# EAGLE design DualMotorCape-v1 (EAGLE 6.3)
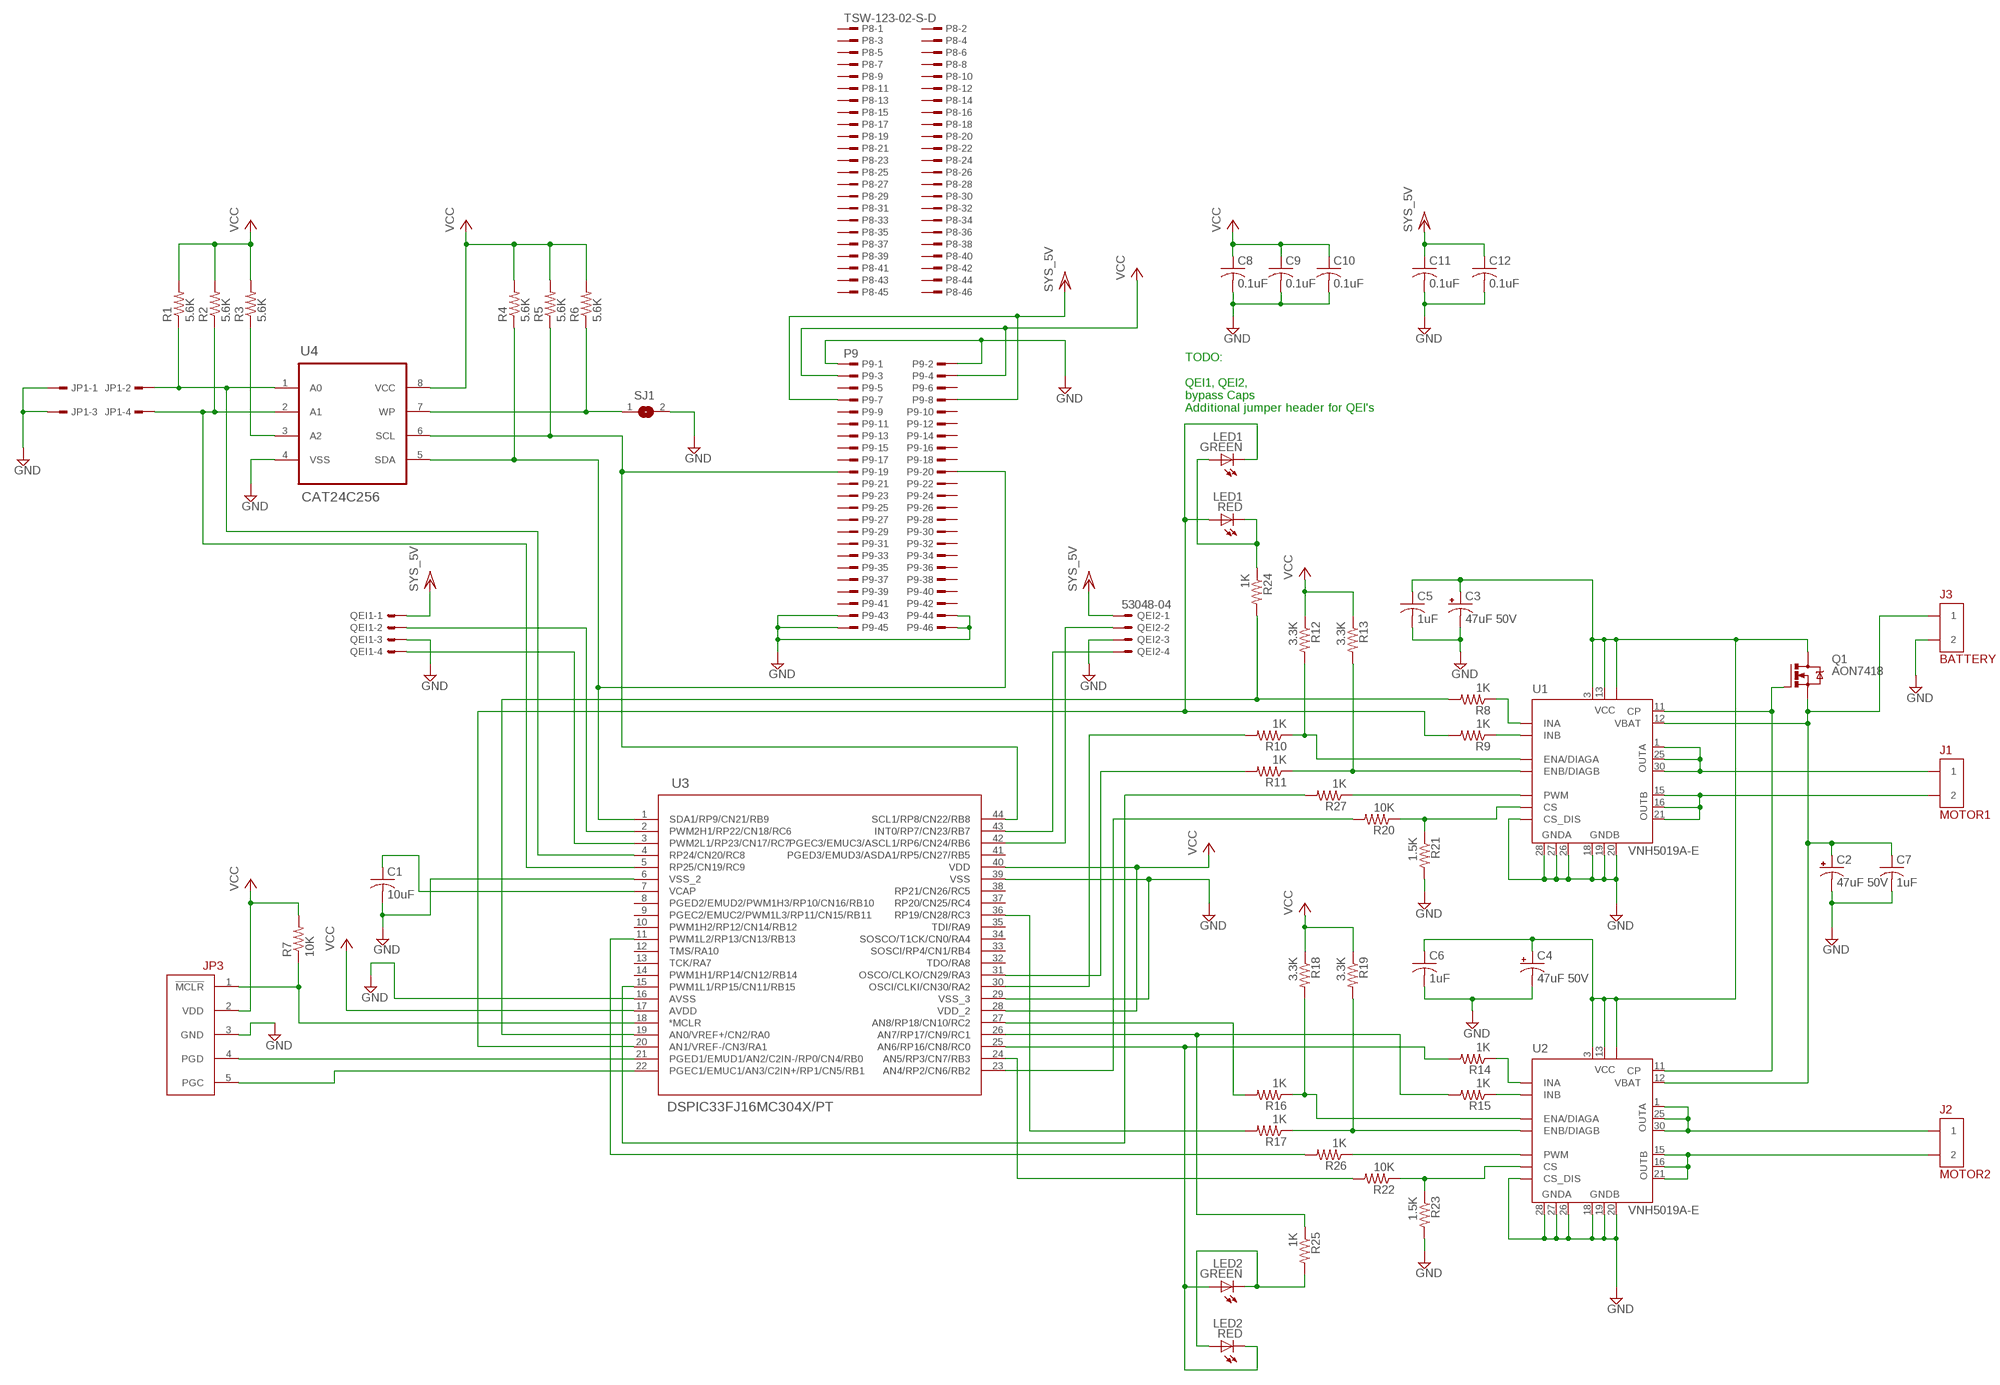
[diagram p0: schematic, sheet 1]

## Parts
C1  10uF  C-USC0805  [C0805]
C2  47uF 50V  CPOL-USUD-6,3X7,7  [UD-6,3X7,7_NICHICON]
C3  47uF 50V  CPOL-USUD-6,3X7,7  [UD-6,3X7,7_NICHICON]
C4  47uF 50V  CPOL-USUD-6,3X7,7  [UD-6,3X7,7_NICHICON]
C5  1uF  C-USC0603  [C0603]
C6  1uF  C-USC0603  [C0603]
C7  1uF  C-USC0603  [C0603]
C8  0.1uF  C-USC0603  [C0603]
C9  0.1uF  C-USC0603  [C0603]
C10  0.1uF  C-USC0603  [C0603]
C11  0.1uF  C-USC0603  [C0603]
C12  0.1uF  C-USC0603  [C0603]
J1  MOTOR1  TERMINAL-BLOCK-2  [TERMINAL-BLOCK-2.54MM-2]
J2  MOTOR2  TERMINAL-BLOCK-2  [TERMINAL-BLOCK-2.54MM-2]
J3  BATTERY  TERMINAL-BLOCK-2  [TERMINAL-BLOCK-2.54MM-2]
JP1  TSW-102-02-S-D  [TSW-102-02-S-D]
JP3  ICD2/3-HEADER  [ICD2/3-HEADER]
LED1  KINGBRIGHT-BI-COLOR-LED  [LED-1.6X1.5MM-BI-COLOR]
LED2  KINGBRIGHT-BI-COLOR-LED  [LED-1.6X1.5MM-BI-COLOR]
P8  TSW-123-02-S-D  [TSW-123-02-S-D]
P9  P9  TSW-123-02-S-D  [TSW-123-02-S-D]
Q1  AON7418  MOSFET-N  [DFN3.3X3.3]
QEI1  53048-04  [53048-04]
QEI2  53048-04  [53048-04]
R1  5.6K  R-US_R0603  [R0603]
R2  5.6K  R-US_R0603  [R0603]
R3  5.6K  R-US_R0603  [R0603]
R4  5.6K  R-US_R0603  [R0603]
R5  5.6K  R-US_R0603  [R0603]
R6  5.6K  R-US_R0603  [R0603]
R7  10K  R-US_R0603  [R0603]
R8  1K  R-US_R0603  [R0603]
R9  1K  R-US_R0603  [R0603]
R10  1K  R-US_R0603  [R0603]
R11  1K  R-US_R0603  [R0603]
R12  3.3K  R-US_R0603  [R0603]
R13  3.3K  R-US_R0603  [R0603]
R14  1K  R-US_R0603  [R0603]
R15  1K  R-US_R0603  [R0603]
R16  1K  R-US_R0603  [R0603]
R17  1K  R-US_R0603  [R0603]
R18  3.3K  R-US_R0603  [R0603]
R19  3.3K  R-US_R0603  [R0603]
R20  10K  R-US_R0603  [R0603]
R21  1.5K  R-US_R0603  [R0603]
R22  10K  R-US_R0603  [R0603]
R23  1.5K  R-US_R0603  [R0603]
R24  1K  R-US_R0603  [R0603]
R25  1K  R-US_R0603  [R0603]
R26  1K  R-US_R0603  [R0603]
R27  1K  R-US_R0603  [R0603]
SJ1  SJ  [SJ]
U1  VNH5019A-E  [VNH5019A-E]
U2  VNH5019A-E  [VNH5019A-E]
U3  DSPIC33FJ16MC304X/PT  [TQFP44_MC]
U4  CAT24C256  [SOIC-8]

## Nets
GND: C1.2 C2.- C3.- C4.- C5.2 C6.2 C7.2 C8.2 C9.2 C10.2 C11.2 C12.2 J3.2 JP1.1 JP1.3 JP3.3(GND) P9.1 P9.2 P9.43 P9.44 P9.45 P9.46 QEI1.3 QEI2.3 R21.2 R23.2 SJ1.2 U1.6(CS_DIS) U1.18(GNDB) U1.19(GNDB) U1.20(GNDB) U1.26(GNDA) U1.27(GNDA) U1.28(GNDA) U2.6(CS_DIS) U2.18(GNDB) U2.19(GNDB) U2.20(GNDB) U2.26(GNDA) U2.27(GNDA) U2.28(GNDA) U3.6(VSS_2) U3.16(AVSS) U3.29(VSS_3) U3.39(VSS) U4.4(VSS)
N$1: C2.+ C7.1 J3.1 Q1.1(S) Q1.2(S) Q1.3(S) U1.12(VBAT) U2.12(VBAT)
N$2: J1.1 U1.1(OUTA) U1.25(OUTA) U1.30(OUTA)
N$3: C3.+ C4.+ C5.1 C6.1 Q1.5(D) Q1.6(D) Q1.7(D) Q1.8(D) U1.3(VCC) U1.13(VCC) U1.23(VCC) U2.3(VCC) U2.13(VCC) U2.23(VCC)
N$4: Q1.4(G) U1.11(CP) U2.11(CP)
N$5: J1.2 U1.15(OUTB) U1.16(OUTB) U1.21(OUTB)
N$6: JP1.2 R1.1 U3.4(RP24/CN20/RC8) U4.1(A0)
N$7: JP1.4 R2.1 U3.5(RP25/CN19/RC9) U4.2(A1)
N$8: J2.1 U2.1(OUTA) U2.25(OUTA) U2.30(OUTA)
N$9: J2.2 U2.15(OUTB) U2.16(OUTB) U2.21(OUTB)
N$10: R3.1 U4.3(A2)
N$11: R6.1 SJ1.1 U4.7(WP)
N$12: P9.19 R5.1 U3.44(SCL1/RP8/CN22/RB8) U4.6(SCL)
N$13: P9.20 R4.1 U3.1(SDA1/RP9/CN21/RB9) U4.5(SDA)
N$14: JP3.5(PGC) U3.22(PGEC1/EMUC1/AN3/C2IN+/RP1/CN5/RB1)
N$15: JP3.1(!MCLR) R7.1 U3.18(*MCLR)
N$16: JP3.4(PGD) U3.21(PGED1/EMUD1/AN2/C2IN-/RP0/CN4/RB0)
N$17: R26.2 U3.11(PWM1L2/RP13/CN13/RB13)
N$18: R11.1 R13.2 U1.9(ENB/DIAGB)
N$19: R10.1 R12.2 U1.5(ENA/DIAGA)
N$20: R27.2 U3.15(PWM1L1/RP15/CN11/RB15)
N$21: R8.1 U1.4(INA)
N$22: R9.1 U1.10(INB)
N$23: R15.1 U2.10(INB)
N$24: R14.1 U2.4(INA)
N$25: R17.1 R19.2 U2.9(ENB/DIAGB)
N$26: R16.1 R18.2 U2.5(ENA/DIAGA)
N$27: R17.2 U3.36(RP19/CN28/RC3)
N$28: R22.1 R23.1 U2.8(CS)
N$29: R20.1 R21.1 U1.8(CS)
N$30: R8.2 R24.2 U3.19(AN0/VREF+/CN2/RA0)
N$31: LED1.1 LED1.4 R9.2 U3.20(AN1/VREF-/CN3/RA1)
N$32: R10.2 U3.30(OSCI/CLKI/CN30/RA2)
N$33: R11.2 U3.31(OSCO/CLKO/CN29/RA3)
N$34: R20.2 U3.23(AN4/RP2/CN6/RB2)
N$35: LED2.2 LED2.3 R14.2 U3.25(AN6/RP16/CN8/RC0)
N$36: R15.2 R25.1 U3.26(AN7/RP17/CN9/RC1)
N$37: R16.2 U3.27(AN8/RP18/CN10/RC2)
N$38: R22.2 U3.24(AN5/RP3/CN7/RB3)
N$39: QEI1.2 U3.2(PWM2H1/RP22/CN18/RC6)
N$40: QEI1.4 U3.3(PWM2L1/RP23/CN17/RC7)
N$41: QEI2.2 U3.42(PGEC3/EMUC3/ASCL1/RP6/CN24/RB6)
N$42: QEI2.4 U3.43(INT0/RP7/CN23/RB7)
N$43: R26.1 U2.7(PWM)
N$44: LED1.2 LED1.3 R24.1
N$45: LED2.1 LED2.4 R25.2
N$46: R27.1 U1.7(PWM)
N$47: C1.1 U3.7(VCAP)
VCC: C8.1 C9.1 C10.1 JP3.2(VDD) P9.3 P9.4 R1.2 R2.2 R3.2 R4.2 R5.2 R6.2 R7.2 R12.1 R13.1 R18.1 R19.1 U3.17(AVDD) U3.28(VDD_2) U3.40(VDD) U4.8(VCC)
VCC/2: C11.1 C12.1 P9.7 P9.8 QEI1.1 QEI2.1 ; supply symbol labelled SYS_5V
Unconnected: P8.1 P8.2 P8.3 P8.4 P8.5 P8.6 P8.7 P8.8 P8.9 P8.10 P8.11 P8.12 P8.13 P8.14 P8.15 P8.16 P8.17 P8.18 P8.19 P8.20 P8.21 P8.22 P8.23 P8.24 P8.25 P8.26 P8.27 P8.28 P8.29 P8.30 P8.31 P8.32 P8.33 P8.34 P8.35 P8.36 P8.37 P8.38 P8.39 P8.40 P8.41 P8.42 P8.43 P8.44 P8.45 P8.46 P9.5 P9.6 P9.9 P9.10 P9.11 P9.12 P9.13 P9.14 P9.15 P9.16 P9.17 P9.18 P9.21 P9.22 P9.23 P9.24 P9.25 P9.26 P9.27 P9.28 P9.29 P9.30 P9.31 P9.32 P9.33 P9.34 P9.35 P9.36 P9.37 P9.38 P9.39 P9.40 P9.41 P9.42 U3.8(PGED2/EMUD2/PWM1H3/RP10/CN16/RB10) U3.9(PGEC2/EMUC2/PWM1L3/RP11/CN15/RB11) U3.10(PWM1H2/RP12/CN14/RB12) U3.12(TMS/RA10) U3.13(TCK/RA7) U3.14(PWM1H1/RP14/CN12/RB14) U3.32(TDO/RA8) U3.33(SOSCI/RP4/CN1/RB4) U3.34(SOSCO/T1CK/CN0/RA4) U3.35(TDI/RA9) U3.37(RP20/CN25/RC4) U3.38(RP21/CN26/RC5) U3.41(PGED3/EMUD3/ASDA1/RP5/CN27/RB5)

## Notes on the sheet
- TODO: 
  
  QEI1, QEI2, 
  bypass Caps
  Additional jumper header for QEI's

## Library data of the parts
C1 C5-C12 = rcl:C-US: CAPACITOR, American symbol
C2-C4 = rcl:CPOL-US: POLARIZED CAPACITOR, American symbol; DIGIKEY: 493-2303-1-ND
J1-J3 = MyCustom:TERMINAL-BLOCK-2
JP1 = con-samtec:TSW-102-02-S-D: THROUGH-HOLE .025" SQ POST HEADER Source: Samtec TSW.pdf; OC_FARNELL: unknown; OC_NEWARK: unknown
JP3 = MyCustom:ICD2/3-HEADER
LED1 LED2 = MyCustom:KINGBRIGHT-BI-COLOR-LED: BI-COLOR SMD CHIP LED 1.6x1.5mm http://www.us.kingbright.com/images/catalog/SPEC/APTB1615ESGC-F01.pdf
P8 P9 = con-samtec:TSW-123-02-S-D: THROUGH-HOLE .025" SQ POST HEADER Source: Samtec TSW.pdf; OC_FARNELL: unknown; OC_NEWARK: unknown
Q1 = MyCustom:MOSFET-N: MOSFET N-Channel http://www.aosmd.com/res/data_sheets/AON7418.pdf http://www.aosmd.com/res/packaging_information/DFN3.3x3.3.pdf
QEI1 QEI2 = con-molex:53?-04: CONNECTOR wire to board 1.25 mm (.049 inch) pitch header; MF: MOLEX; MPN: 53048-0410; OC_FARNELL: 1462887; OC_NEWARK: 57H4721
R1-R27 = rcl:R-US_: RESISTOR, American symbol
SJ1 = jumper:SJ: SMD solder JUMPER
U1 U2 = MyCustom:VNH5019A-E
U3 = MyCustom:DSPIC33FJ16MC304X/PT
U4 = MyCustom:CAT24C256: ON Semi CAT24C256 CMOS Serial EEPROM http://www.onsemi.com/pub_link/Collateral/CAT24C256-D.PDF

## Board
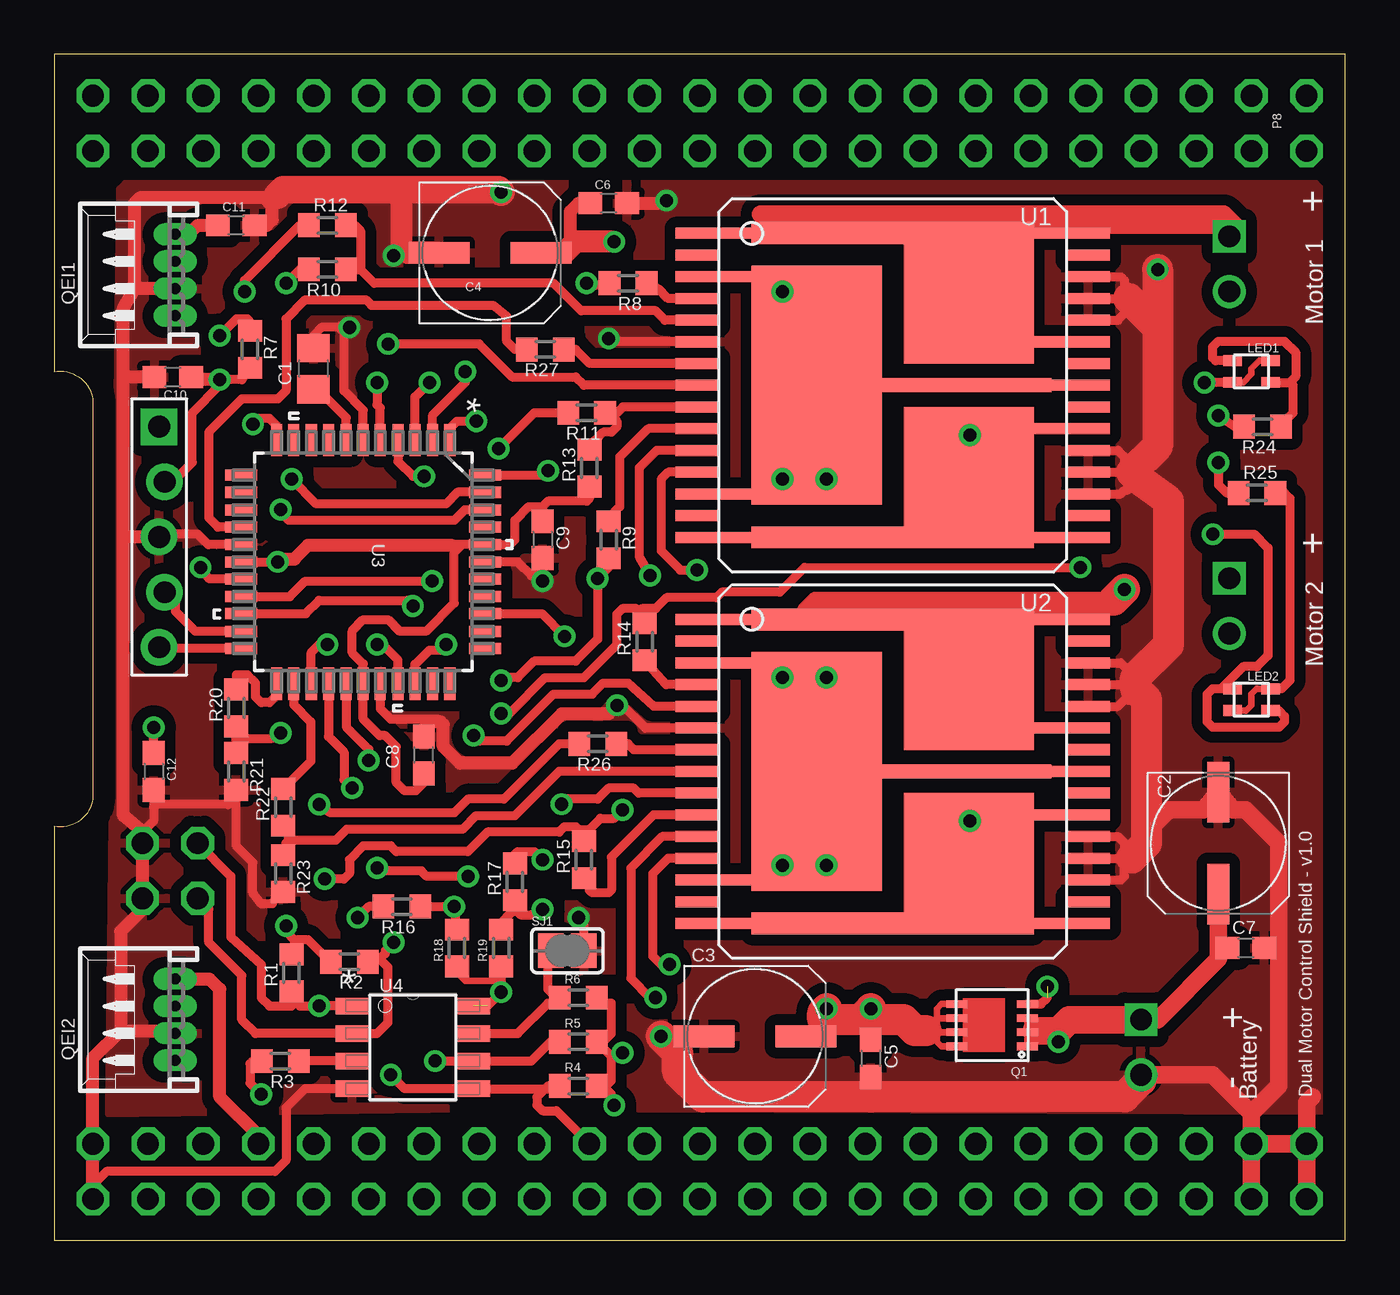
[diagram p1: board, top side]
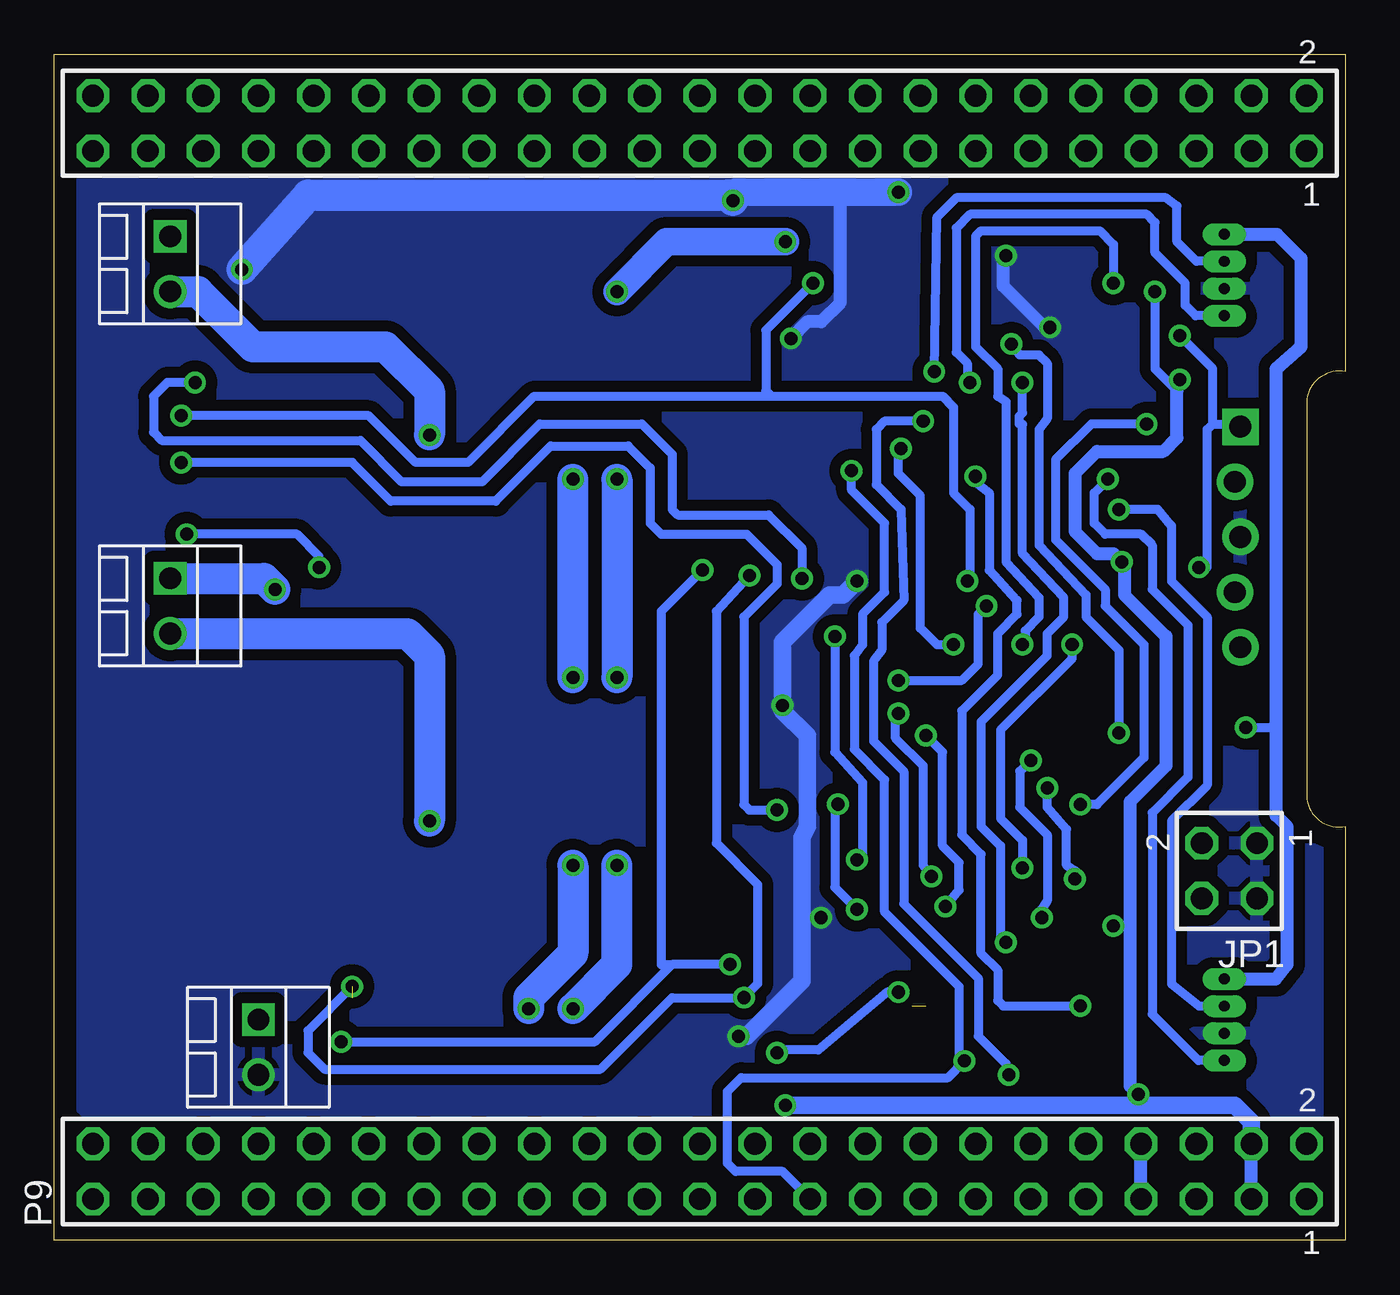
[diagram p2: board, bottom side, seen from below]

Size 59.44 x 54.61 mm. Coordinates in mm from the lower left corner, seen from the top.
Outline: 0,0 59.44,0 59.44,54.61 0,54.61 0,40.01 arc-90 1.78,38.73 1.78,20.32 arc-90 0,19.05 0,0
Copper layers (1*16): Top 0.035mm / dielectric 1.5mm / Bottom 0.035mm
Design rules "default *": minimum track width 10mil, minimum drill 21mil, track to track 8mil, track to pad 8mil, pad to pad 8mil, via to via 8mil, smd to smd 8mil, copper to edge 40mil, drill to drill 8mil, minimum pad ring 10mil, minimum via ring 8mil, stop-mask expansion 4mil, vias tented up to drill 0mil, thermal gap 10mil
bKeepout: area 51.9,10.8 to 58.9,26

### Footprints (pad centres in the part's own frame; a part is rotated, then mirrored left to right if it is on the bottom)
C0805 = smd 1.3 x 1.5: 1 -0.95,0; 2 0.95,0
UD-6,3X7,7_NICHICON = smd 2.8 x 1: + 2.35,0; - -2.35,0
C0603 = smd 1.1 x 1: 1 -0.85,0; 2 0.85,0
TERMINAL-BLOCK-2.54MM-2 = drill 1 square: 1 0,1.27 | drill 1: 2 0,-1.27
TSW-102-02-S-D = drill 1 pad 1.5 octagon: 1 1.27,-1.27; 2 1.27,1.27; 3 -1.27,-1.27; 4 -1.27,1.27
ICD2/3-HEADER = drill 1 pad 1.676 square: 1 0,6.35 | drill 1 pad 1.676: 2 0.254,3.81; 3 0,1.27; 4 0.254,-1.27; 5 0,-3.81
LED-1.6X1.5MM-BI-COLOR = smd 0.85 x 0.5: 1 0.875,0.5; 2 -0.875,0.5; 3 0.875,-0.5; 4 -0.875,-0.5
TSW-123-02-S-D = drill 1 pad 1.5 octagon: 1 27.94,-1.27; 2 27.94,1.27; 3 25.4,-1.27; 4 25.4,1.27; 5 22.86,-1.27; 6 22.86,1.27; 7 20.32,-1.27; 8 20.32,1.27; 9 17.78,-1.27; 10 17.78,1.27; 11 15.24,-1.27; 12 15.24,1.27; 13 12.7,-1.27; 14 12.7,1.27; 15 10.16,-1.27; 16 10.16,1.27; 17 7.62,-1.27; 18 7.62,1.27; 19 5.08,-1.27; 20 5.08,1.27; 21 2.54,-1.27; 22 2.54,1.27; 23 0,-1.27; 24 0,1.27; 25 -2.54,-1.27; 26 -2.54,1.27; 27 -5.08,-1.27; 28 -5.08,1.27; 29 -7.62,-1.27; 30 -7.62,1.27; 31 -10.16,-1.27; 32 -10.16,1.27; 33 -12.7,-1.27; 34 -12.7,1.27; 35 -15.24,-1.27; 36 -15.24,1.27; 37 -17.78,-1.27; 38 -17.78,1.27; 39 -20.32,-1.27; 40 -20.32,1.27; 41 -22.86,-1.27; 42 -22.86,1.27; 43 -25.4,-1.27; 44 -25.4,1.27; 45 -27.94,-1.27; 46 -27.94,1.27
DFN3.3X3.3 = smd 0.95 x 0.35: 1 -1.62,0.975; 2 -1.62,0.325; 3 -1.62,-0.325; 4 -1.62,-0.975; 5 1.62,-0.975; 6 1.62,-0.325; 7 1.62,0.325; 8 1.62,0.975
53048-04 = drill 0.5 pad 0.698 long: 1 1.875,-1.25; 2 0.625,-1.25; 3 -0.625,-1.25; 4 -1.875,-1.25
R0603 = smd 1 x 1.1: 1 -0.85,0; 2 0.85,0
SJ = smd 1.168 x 1.6: 1 -0.762,0; 2 0.762,0
VNH5019A-E = smd 0.508 x 12: 1 -7,-4; 15 7,-4; 16 7,4; 30 -7,4 | smd 0.508 x 2: 2 -6,-9; 4 -4,-9; 5 -3,-9; 6 -2,-9; 7 -1,-9; 8 0,-9; 9 1,-9; 10 2,-9; 11 3,-9; 12 4,-9; 14 6,-9; 17 6,9; 18 5,9; 19 4,9; 20 3,9; 22 1,9; 24 -1,9; 26 -3,9; 27 -4,9; 28 -5,9; 29 -6,9 | smd 0.508 x 4: 3 -5,-8; 13 5,-8; 21 2,8; 23 0,8; 25 -2,8 | smd 6.5 x 6: NC/OUTA -4.25,3.5; NC/OUTB 4.25,3.5 | smd 1 x 7.5: NC/OUTA@1 -7,-2.755; NC/OUTB@1 7,-2.755 | smd 11 x 6: NC/VCC 0,-3.5 | smd 0.65 x 8.3: NC/VCC@1 0,3.145
TQFP44_MC = smd 1.473 x 0.508: 1 -5.613,3.988; 2 -5.613,3.2; 3 -5.613,2.388; 4 -5.613,1.6; 5 -5.613,0.787; 6 -5.613,0; 7 -5.613,-0.787; 8 -5.613,-1.6; 9 -5.613,-2.388; 10 -5.613,-3.2; 11 -5.613,-3.988; 23 5.613,-3.988; 24 5.613,-3.2; 25 5.613,-2.388; 26 5.613,-1.6; 27 5.613,-0.787; 28 5.613,0; 29 5.613,0.787; 30 5.613,1.6; 31 5.613,2.388; 32 5.613,3.2; 33 5.613,3.988 | smd 0.508 x 1.473: 12 -3.988,-5.613; 13 -3.2,-5.613; 14 -2.388,-5.613; 15 -1.6,-5.613; 16 -0.787,-5.613; 17 0,-5.613; 18 0.787,-5.613; 19 1.6,-5.613; 20 2.388,-5.613; 21 3.2,-5.613; 22 3.988,-5.613; 34 3.988,5.613; 35 3.2,5.613; 36 2.388,5.613; 37 1.6,5.613; 38 0.787,5.613; 39 0,5.613; 40 -0.787,5.613; 41 -1.6,5.613; 42 -2.388,5.613; 43 -3.2,5.613; 44 -3.988,5.613
SOIC-8 = smd 1.524 x 0.762: 1 -2.794,1.905; 2 -2.794,0.635; 3 -2.794,-0.635; 4 -2.794,-1.905; 5 2.794,-1.905; 6 2.794,-0.635; 7 2.794,0.635; 8 2.794,1.905

### Placement (x,y rotation side)
C1  11.94,40.13 90 top
C2  53.59,18.29 270 top
C3  32.26,9.4 0 top
C4  20.07,45.47 0 top
C5  37.59,8.38 270 top
C6  25.53,47.75 0 top
C7  54.86,13.46 0 top
C8  17.02,22.35 90 top
C9  22.48,32.26 270 top
C10  5.46,39.75 180 top
C11  8.38,46.74 0 top
C12  4.57,21.59 270 top
J1  54.1,44.96 0 bottom
J2  54.1,29.21 0 bottom
J3  50.04,8.89 0 bottom
JP1  5.33,17.02 90 bottom
JP3  4.83,31.11 0 top
LED1  55.12,40.01 180 top
LED2  55.12,24.89 180 top
P8  29.72,51.44 0 bottom
P9  29.72,3.17 0 bottom
Q1  43.18,9.91 180 top
QEI1  4.32,44.45 90 top
QEI2  4.32,10.16 90 top
R1  10.92,12.32 90 top
R2  13.59,12.83 180 top
R3  10.41,8.26 180 top
R4  24.13,7.11 0 top
R5  24.13,9.14 0 top
R6  24.13,11.18 0 top
R7  9.02,41.02 270 top
R8  26.42,44.07 180 top
R9  25.53,32.26 270 top
R10  12.57,44.7 180 top
R11  24.51,38.1 180 top
R12  12.57,46.74 0 top
R13  24.64,35.56 90 top
R14  27.18,27.56 90 top
R15  24.38,17.53 90 top
R16  16,15.37 180 top
R17  21.21,16.51 90 top
R18  18.54,13.46 90 top
R19  20.57,13.46 90 top
R20  8.38,24.51 90 top
R21  8.38,21.59 270 top
R22  10.54,19.94 90 top
R23  10.54,16.89 270 top
R24  55.63,37.47 180 top
R25  55.37,34.42 0 top
R26  25.02,22.86 180 top
R27  22.61,41.02 180 top
SJ1  23.62,13.34 0 top
U1  38.61,39.37 270 top
U2  38.61,21.59 270 top
U3  14.22,31.24 270 top
U4  16.51,8.89 0 top

### Tracks (layer width: path | path; a pad name or v marks a point on that pad's centre or on a via)
GND  (via drill 0.6)
  Top 0.305: C5.2 37.59,6.6
  Top 0.406: U1.28 49.1,44.37 49.28,44.2 49.28,43.37 | U1.26 48.97,42.37 49.72,43.12 | U1.18 49.1,34.37 49.28,34.54 49.4,34.54 49.91,35.05 | U1.20 48.97,36.37 49.28,36.07 49.28,35.37 | U2.28 49.1,26.59 49.78,25.91 | U2.26 48.97,24.59 49.28,24.89 49.78,24.89 50.04,25.15 | U2.18 49.1,16.59 49.28,16.76 49.28,17.59 | U2.20 48.97,18.59 49.28,18.29 49.28,17.59 | U2.19 49.28,17.59 | 49.28,17.59 49.59,17.59 | U1.27 49.28,43.37 | 49.28,43.37 49.47,43.37 | U2.27 49.59,25.59 49.78,25.4 | U1.19 49.28,35.37 | 49.28,35.37 49.59,35.37 | 50.04,18.54 50.29,18.29 | C7.2 56.13,13.46 56.39,13.72 | U1.6 25.69,41.37 v25.53,41.53 | U2.6 27.21,23.59 26.16,24.64 v25.91,24.64 | 1.78,2.54 2.41,3.17 10.16,3.17 10.67,3.68 10.67,6.1 11.56,6.99 U4.4 | C12.2 4.57,19.94 | 4.57,19.94 4.57,19.3 4.06,18.8 | 4.57,19.94 4.7,20.07 8,20.07 8.38,20.45 R21.2 8.38,18.16 9.14,17.4 9.14,16 9.53,15.49 10.03,15.49 10.29,16 R23.2 | SJ1.2 24.38,14.61 v24.13,14.86 | U3.6 14.22,38.23 13.34,39.12 13.34,41.91 13.21,42.04 12.32,42.04 11.94,41.66 C1.2 | v22.48,30.35 C9.2 22.48,31.11 21.97,30.61 21.34,31.24 U3.39 | U3.29 15.01,24.49 15.49,24 17.65,24 17.78,23.88 | U3.16 7.09,32.03 6.6,32.51 4.95,32.51 JP3.3
  Top 0.61: P9.1 1.78,2.54 P9.2 1.78,8.38 3.05,9.65 | 3.05,9.65 5.45,9.65 QEI2.3 | 3.05,9.65 3.05,14.22 4.06,15.24 JP1.3 JP1.1 4.06,18.8 3.17,19.56 3.17,32.51 | 3.17,32.51 3.17,39.62 | 3.17,39.62 3.17,42.93 3.69,43.83 | QEI1.3 3.69,43.83 | JP3.3 3.3,32.38 3.17,32.51 | C10.2 3.3,39.75 3.17,39.62 | C11.2 9.78,46.74 10.03,46.99 10.03,47.62 | 10.03,47.62 9.65,48.01 3.94,48.01 3.68,47.75 3.68,43.84 3.69,43.83 | 10.29,48.13 10.29,47.88 10.03,47.62 | C6.2 27.81,47.75 v28.19,47.88 | 25.78,24.51 v25.91,24.64 25.53,24.26 23.37,24.26 21.08,21.97 18.67,21.97 17.91,22.73 17.91,23.75 17.78,23.88 17.27,23.88 17.14,23.75 17.14,23.33 C8.2 | 13.21,42.04 v13.59,42.04 | v15.62,45.34 15.88,45.34 16.13,45.59
  Top 0.813: 50.04,18.54 51.31,19.81 52.9,19.81 C2.- 54.29,19.81 54.86,19.81 56.39,18.29 56.39,13.72 56.39,7.11 55.12,5.84 | J3.2 53.34,7.62 55.12,5.84 | P9.44 P9.43 | P9.44 55.12,5.84 | P9.46 P9.44 | C3.- v27.94,9.4 | P9.46 57.66,6.35 57.91,6.6 | P9.45 P9.46
  Top 1.016: C4.- 16.26,45.47 16.13,45.59 16,45.72 16,48.13 16.26,48.39
  Top 1.27: 10.29,48.13 10.54,48.39 16.26,48.39 20.45,48.39 v20.57,48.26
  Top 1.422: 49.59,17.59 50.29,18.29 50.29,24.89 50.04,25.15 49.78,25.4 49.78,25.91 51.31,27.43 51.31,34.04 49.91,35.05 49.59,35.37 50.8,36.58 50.8,42.04 | 50.8,42.04 49.72,43.12 49.47,43.37 | J3.2 50.04,7.37 49.28,6.6 37.59,6.6 29.84,6.6 28.7,7.75 28.7,8.64 v27.94,9.4 | v50.8,44.7 50.8,42.04
  Bottom 0.406: v24.13,14.86 24.89,14.86 25.02,14.73
  Bottom 0.61: v27.94,9.4 27.56,9.4 | 23.24,48.26 23.24,43.18 24.13,42.29 24.77,42.29 v25.53,41.53 | v13.59,42.04 13.84,42.04 15.75,43.94 15.75,45.21 v15.62,45.34
  Bottom 0.813: 27.56,9.4 25.02,11.94 25.02,14.73 25.02,18.54 24.77,19.05 24.77,23.24 25.91,24.38 v25.91,24.64 25.91,27.56 23.75,29.72 23.11,29.72 v22.48,30.35
  Bottom 1.27: v20.57,48.26 23.24,48.26 28.07,48.26 v28.19,47.88
  Bottom 1.422: v50.8,44.7 47.75,48.13 28.45,48.13 v28.19,47.88
  pour Bottom (isolate 0.508): 1.52,48.77 58.17,48.77 58.17,6.1 57.91,5.84 1.27,5.84 1.02,6.1 1.02,17.78 3.05,18.8 3.05,40.13 1.52,41.66
  pour Top (isolate 0.508): 58.29,5.97 20.57,6.1 2.54,5.84 3.05,48.39 3.3,48.64 58.04,48.64 58.29,48.39
N$1  (via drill 0.6)
  Top 0.305: Q1.1 44.8,9.65 | 44.8,9.65 Q1.3 | 44.87,9.65 44.8,9.65
  Top 0.406: C7.1 53.85,13.46 53.59,13.21 | 45.21,9.65 44.87,9.65 Q1.2 | U2.12 28.26,17.59 27.56,16.89 27.56,13.08 27.94,12.7 v28.32,12.7 | v46.23,9.14 46.23,9.65 | U1.12 28.26,35.37 27.94,35.05 27.94,31.75 28.83,30.86 v29.59,30.86
  Top 0.813: C2.+ 53.59,13.21 53.59,12.95 50.8,10.16 J3.1
  Top 1.27: J3.1 46.74,10.16 46.23,9.65 45.21,9.65
  Bottom 0.406: v46.23,9.14 34.54,9.14 30.99,12.7 | v28.32,12.7 30.99,12.7 | v29.59,30.86 31.5,28.96 31.5,12.7 30.99,12.7
N$2
  Top 0.406: U1.25 43.47,41.37 43.18,41.66 43.18,45.72 42.16,46.74
  Top 0.813: 44.7,46.74 44.34,46.37 U1.30 U1.1 | 44.7,46.74 51.31,46.74 | 54.1,46.74 54.36,46.74 53.85,47.24 50.8,47.24 | 54.1,46.74 J1.1 | U1.1 34.69,46.37 35.05,46.74 | 42.16,46.74 44.7,46.74 | U1.1 33.39,46.37 32.51,47.24 50.8,47.24 | 54.1,46.74 51.31,46.74 | 51.31,46.74 50.8,47.24
N$3  (via drill 0.6)
  Top 0.305: Q1.8 40.85,8.93 40.64,9.14 40.64,9.65 | Q1.7 40.71,9.58 40.64,9.65 | Q1.6 40.71,10.23 | 40.71,10.23 40.64,10.16 | 40.64,10.16 40.64,9.65 | Q1.5 40.85,10.88 40.64,10.67 40.64,10.3 | 40.64,10.3 40.71,10.23 | 40.64,10.3 40.64,10.16 | 40.64,10.16 40.13,9.65 | C5.1 37.68,9.23 38.61,10.16 | C3.+ 35.37,10.16
  Top 0.406: U1.23 37.34,39.37 | 37.34,39.37 33.78,42.93 33.27,43.43 | 33.27,43.43 32.51,44.2 | 32.51,44.2 33.02,44.2 | U1.3 32.34,44.37 32.51,44.2 | U1.13 33.35,34.37 33.53,34.54 v33.53,35.05 | U2.23 36.83,21.59 33.02,17.78 v33.53,17.27 33.53,16.76 33.02,16.76 32.85,16.59 U2.13 | v33.53,43.69 33.27,43.43 | U2.3 32.85,26.59 v33.53,25.91 | v35.56,35.05 35.56,37.59 37.34,39.37
  Top 0.61: 23.5,45.47 C4.+ | C6.1 24.13,47.75 23.75,47.37 23.75,46.23 24,45.97
  Top 1.016: v25.78,45.97 24,45.97 23.5,45.47
  Top 1.422: 40.13,9.65 39.62,9.65 39.12,10.16 38.61,10.16 37.08,10.16 | 37.08,10.16 35.37,10.16 35.37,10.48 v35.56,10.67 | v33.53,17.27 33.02,17.27 | 36.83,21.59 36.83,22.61 v33.53,25.91 | v33.53,25.91 33.53,19.3 | v37.59,10.67 37.08,10.16 | v33.53,25.91 v35.56,25.91 | 33.53,43.18 33.78,42.93
  Bottom 1.27: v25.78,45.97 31.24,45.97 v33.53,43.69
  Bottom 1.422: v35.56,10.67 33.53,12.7 v33.53,17.27 | v35.56,17.27 35.56,13.21 37.59,11.18 v37.59,10.67 | v35.56,25.91 v35.56,35.05 | v33.53,35.05 v33.53,25.91
N$4  (via drill 0.6)  (1 unrouted)
  Top 0.406: Q1.4 45.42,10.88 45.72,11.18 | U1.11 27.73,36.37 26.92,35.56 26.92,31.5 v27.43,30.61 | U2.11 27.99,18.59 26.54,17.14 26.54,12.06 27.43,11.18 v27.69,11.18
  Bottom 0.406: v45.72,11.68 47.75,9.65 47.75,8.64 46.99,7.87 34.29,7.87 30.99,11.18 v27.69,11.18 27.05,11.81 27.05,16.38 28.96,18.29 28.96,28.96 v27.43,30.61
N$5  (via drill 0.6)
  Top 0.406: U1.15 34.75,32.51 42.47,32.51 U1.16 42.61,36.64 v42.16,37.08 44.7,37.08 44.99,37.37 U1.21
  Bottom 1.422: J1.2 52.83,43.69 50.29,41.15 44.2,41.15 42.16,39.12 v42.16,37.08
N$6  (via drill 0.6)
  Top 0.406: JP1.2 8.13,16.76 8.13,13.97 9.53,12.7 9.53,11.18 9.91,10.79 10.92,10.79 11.05,10.92 | U3.4 15.82,35.87 16.51,35.18 v17.02,35.18 | U4.1 v12.19,10.79 11.3,10.79 11.18,10.92 11.05,10.92 | 11.05,10.92 11.05,11.34 R1.1
  Bottom 0.406: v17.02,35.18 17.02,34.92 16.38,34.42 16.38,30.86 15.11,29.46 15.11,28.83 16,27.94 16,26.04 17.65,24.38 17.65,18.67 16.76,17.78 16.76,13.21 16,12.45 16,11.05 15.75,10.79 v12.19,10.79
N$7  (via drill 0.6)
  Top 0.406: JP1.4 7.11,15.24 7.11,13.72 8.64,12.19 8.64,10.16 9.27,9.53 U4.2 14.86,9.53 15.37,10.03 15.37,12.57 14.99,12.95 | v14.86,39.5 14.86,38.48 15.01,38.33 U3.5 | v15.62,13.72 15.24,13.34 15.24,13.21 14.99,12.95 | R2.1 14.99,12.95
  Bottom 0.406: v14.86,39.5 14.86,38.1 15.01,37.95 15.01,37.59 14.86,37.57 14.86,31.62 12.95,29.59 12.95,28.7 13.72,27.94 13.72,26.92 16.76,23.88 16.76,19.05 15.88,18.16 15.88,13.97 v15.62,13.72
N$8  (via drill 0.6)
  Top 0.406: U2.25 43.97,23.59 42.67,24.89 42.67,28.53 U2.30
  Top 0.813: U2.30 44.85,28.59 45.21,28.96 48.26,28.96 48.77,29.46 35.05,29.46 34.61,29.02 U2.1
  Top 1.422: v49.28,29.97 48.77,29.46
  Bottom 1.422: J2.1 49.78,30.48 v49.28,29.97
N$9  (via drill 0.6)
  Top 0.406: U2.21 42.45,19.59 v42.16,19.3 42.61,18.86 U2.16 42.47,14.73 34.75,14.73 U2.15
  Bottom 1.422: J2.2 43.18,27.94 42.16,26.92 v42.16,19.3
N$10
  Top 0.406: U4.3 R3.1
N$11
  Top 0.406: SJ1.1 22.73,13.21 22.73,11.56 23.11,11.18 R6.1 23.03,10.92 22.73,10.92 21.34,9.53 U4.7
N$12  (via drill 0.6)
  Top 0.406: v17.53,8.26 U4.6 21.97,8.26 22.86,9.14 R5.1 | U3.44 22.53,35.23 v22.73,35.43
  Bottom 0.406: P9.19 25.91,3.17 28.07,3.17 28.45,3.56 28.45,6.86 27.81,7.49 18.29,7.49 v17.53,8.26 17.78,8.51 17.78,11.68 21.21,15.11 21.21,21.21 22.61,22.61 22.61,26.92 22.23,27.43 22.23,28.83 21.21,29.84 21.21,33.02 22.73,34.54 v22.73,35.43
N$13  (via drill 0.6)
  Top 0.406: P9.20 23.11,5.97 22.48,5.97 22.23,6.22 22.23,6.6 22.73,7.11 R4.1 22.77,6.99 U4.5 16.13,6.99 v15.49,7.62 | U3.1 18.21,37.39 18.54,37.72 v19.43,37.72
  Bottom 0.406: v15.49,7.62 15.62,7.49 15.62,8.13 16.89,9.4 16.89,12.06 20.32,15.49 20.32,21.59 21.72,22.99 21.72,26.67 21.34,27.18 21.34,28.45 20.32,29.46 20.45,33.66 21.59,34.8 21.59,37.34 21.21,37.72 v19.43,37.72
N$14
  Top 0.406: U3.22 4.88,27.25 JP3.5
N$15  (via drill 0.6)
  Top 0.406: U3.18 7.14,30.45 v6.73,30.99 | R7.1 9.02,42.29 8.89,42.42 8.38,42.42 v7.62,41.66
  Bottom 0.406: v6.73,30.99 6.35,30.99 6.35,37.34 6.1,37.59 | 6.1,37.59 4.95,37.59 JP3.1 | 6.1,37.59 6.1,40.13 v7.62,41.66
N$16
  Top 0.406: U3.21 6.5,28.04 5.59,28.96 5.59,29.34 JP3.4
N$17  (via drill 0.6)
  Top 0.406: U3.11 10.24,37.52 9.91,37.85 9.4,37.85 v9.14,37.59 | R26.2 23.24,22.86 20.7,20.32 19.05,20.32 18.41,19.68 12.7,19.68 v12.19,20.07
  Bottom 0.406: v9.14,37.59 11.68,37.59 13.34,35.94 13.34,32.26 11.05,29.97 11.05,29.21 9.27,27.43 9.27,22.23 11.43,20.07 v12.19,20.07
N$18
  Top 0.406: U1.9 26.18,38.37 25.91,38.1 R11.1 25.53,38.1 25.91,37.72 25.91,37.47 25.65,37.21 25.27,37.21 24.89,36.83 24.89,36.66 R13.2
N$19
  Top 0.406: R10.1 14.1,44.7 | 14.1,44.7 14.73,44.07 22.99,44.07 24.26,42.8 27.69,42.8 28.11,42.37 U1.5 | R12.2 13.84,46.74 14.1,46.48 14.1,44.7
N$20
  Top 0.406: U3.15 7.54,32.84 7.11,33.27 7.11,37.21 8.64,38.73 10.29,38.73 10.67,39.12 10.67,42.42 11.56,43.31 14.35,43.31 14.61,43.05 20.19,43.05 20.83,42.55 20.83,41.4 21.21,41.02 R27.2
N$21
  Top 0.406: U1.4 28.26,43.37 27.81,43.81 27.39,43.81 R8.1
N$22
  Top 0.406: U1.10 27.34,37.37 26.04,36.07 26.04,33.78 25.78,33.53 25.78,33.23 R9.1
N$23
  Top 0.406: U2.10 27.59,19.59 25.65,17.65 25.65,16.13 25.53,16 24.77,16 24.64,16.13 24.64,16.42 R15.1
N$24
  Top 0.406: U2.4 28.17,25.59 R14.1
N$25  (via drill 0.6)
  Top 0.305: v22.48,15.24 22.23,15.24 21.97,14.99
  Top 0.406: U2.9 26.91,20.59 26.67,20.83 25.53,20.83 25.02,20.32 23.59,20.32 v23.35,20.08 | R19.2 20.57,14.61 21.08,15.11 21.08,15.53 R17.1 21.21,15.24 21.46,14.99 21.97,14.99
  Bottom 0.406: v23.35,20.08 23.35,20.34 23.5,20.19 23.5,16.26 v22.48,15.24
N$26  (via drill 0.6)
  Top 0.406: U2.5 27.61,24.59 26.42,25.65 25.27,25.65 24.77,25.15 22.99,25.15 20.83,22.99 19.56,22.99 v19.3,23.24 | R18.2 v18.41,15.37 | 18.41,15.49 v18.41,15.37 | R16.1 v18.41,15.37
  Bottom 0.406: v18.41,15.37 17.78,16.13 17.78,17.4 18.54,18.16 18.54,22.48 v19.3,23.24
N$27  (via drill 0.6)
  Top 0.406: U3.36 22.45,28.85 v23.5,27.81 | R17.2 21.21,17.78 21.34,17.91 22.1,17.91 v22.48,17.53
  Bottom 0.406: v23.5,27.81 23.5,22.48 22.23,21.08 22.23,17.78 v22.48,17.53
N$28
  Top 0.406: U2.8 23.24,21.59 21.21,19.56 19.43,19.56 18.8,18.92 13.46,18.92 12.95,18.41 10.79,18.41 | 10.67,18 R23.1 10.67,17.87 10.67,18.29 10.79,18.41 | 10.79,18.41 10.79,18.84 R22.1
N$29  (via drill 0.6)
  Top 0.406: U1.8 24.38,39.37 24,39.75 21.08,39.75 19.56,41.27 v15.37,41.27 | R21.1 R20.1 8.38,23.37 8.64,23.11 10.03,23.11 v10.41,23.37
  Bottom 0.406: v15.37,41.27 14.99,40.77 14.1,40.77 13.72,40.39 13.72,37.85 14.1,37.34 14.1,32 11.94,29.72 11.94,28.7 10.41,27.18 v10.41,23.37
N$30  (via drill 0.6)
  Top 0.406: R24.2 54.36,37.47 v53.59,37.97 | U3.19 10.85,29.64 11.56,30.35 v17.4,30.35 | R8.2 24.77,43.94 v24.51,44.07
  Bottom 0.406: 26.42,38.86 37.34,38.86 40.39,35.81 42.8,35.81 44.96,37.97 v53.59,37.97 | 26.42,38.86 18.54,38.86 18.03,38.35 18.03,34.42 17.27,33.66 17.27,30.48 v17.4,30.35 | v24.51,44.07 26.67,41.91 26.67,39.12 26.42,38.86
N$31  (via drill 0.6)
  Top 0.305: LED1.4 55.49,40.51 55.12,40.13 55.12,39.88 54.74,39.51 LED1.1
  Top 0.406: LED1.1 52.71,39.51 v52.96,39.5 | 25.53,31.24 R9.2 25.53,30.99 v25.02,30.48 25.02,27.69 24,26.67 22.1,26.67 21.34,25.91 20.7,25.91 v20.57,25.78 | U3.20 11.58,28.85 12.19,29.46 16.26,29.46 v16.51,29.21
  Bottom 0.406: v52.96,39.5 54.23,39.5 54.86,38.86 54.86,37.21 54.48,36.83 45.34,36.83 43.43,34.92 39.75,34.92 37.08,37.59 32.38,37.59 30.99,36.2 30.99,33.66 30.73,33.4 26.54,33.4 25.02,31.88 v25.02,30.48 | v20.57,25.78 17.65,25.78 16.89,26.54 16.89,28.83 v16.51,29.21
N$32  (via drill 0.6)
  Top 0.406: U3.30 15.82,26.72 15.11,27.43 v14.86,27.43 | R10.2 11.3,44.7 v10.67,44.07
  Bottom 0.406: v10.67,44.07 10.67,45.85 11.3,46.48 16.76,46.48 17.02,46.23 17.02,41.15 16,40.13 16,38.86 15.62,38.61 15.62,31.24 14.1,29.59 14.1,28.7 14.73,28.07 14.73,27.56 v14.86,27.43
N$33  (via drill 0.6)
  Top 0.406: R11.2 22.1,38.1 v20.45,36.45 | U3.31 16.61,26.52 17.27,27.18 17.78,27.18 v18.03,27.43
  Bottom 0.406: v20.45,36.45 20.57,36.32 20.57,35.31 19.56,34.29 19.56,28.19 18.8,27.43 v18.03,27.43
N$34
  Top 0.406: U3.23 10.24,25.09 9.91,24.77 9.53,24.77 9.27,25.02 9.27,25.65 8.89,26.04 8.38,26.04 R20.2
N$35  (via drill 0.6)
  Top 0.406: LED2.2 56.38,24.39 56.64,24.13 56.64,23.88 56.39,23.62 53.34,23.62 53.09,23.88 53.09,25.15 53.34,25.4 53.72,25.4 | 53.72,25.4 LED2.3 | v47.24,30.99 34.54,30.99 33.4,29.84 30.73,29.84 30.48,29.59 28.19,29.59 27.69,29.08 27.05,29.08 26.92,28.96 | R14.2 26.92,28.96 | 26.92,28.96 26.8,29.08 26.16,29.08 25.91,28.83 25.91,27.43 24.38,25.91 22.61,25.91 20.95,24.26 v20.57,24.26 | v19.05,16.76 17.14,16.76 16.89,17.02 14.86,17.02 v14.86,17.14 | U3.25 11.84,27.08 12.19,27.43 v12.57,27.43 | v53.34,32.51 55.24,32.51 55.88,31.88 55.88,26.92 55.37,26.42 54.74,26.42 53.72,25.4
  Bottom 0.406: v47.24,30.99 47.24,31.5 48.26,32.51 v53.34,32.51 | v19.05,16.76 19.43,17.27 19.43,21.84 20.7,23.11 20.7,24.13 v20.57,24.26 | v12.57,27.43 12.57,26.8 15.88,23.5 15.88,19.43 14.86,18.41 v14.86,17.14
N$36  (via drill 0.6)
  Top 0.406: 24.13,18.92 24,19.05 23.5,19.05 23.24,18.8 19.94,18.8 19.05,17.91 15.75,17.91 15.49,18.16 14.22,18.16 13.59,17.53 13.59,16.89 13.34,16.64 v12.45,16.64 | 24.13,18.92 24.13,18.63 R15.2 | 24.13,18.92 24.64,18.92 25.15,19.43 25.78,19.43 v26.16,19.81 | U3.26 12.62,23.19 13.34,22.48 13.34,21.21 v13.72,20.83 13.72,21.08 | v53.59,35.81 53.59,34.8 53.98,34.42 R25.1
  Bottom 0.406: v26.16,19.81 27.43,19.81 27.69,20.07 27.69,28.7 26.16,30.23 26.16,31.11 27.56,32.51 31.5,32.51 32,33.02 32,35.56 33.02,36.58 36.58,36.58 39.12,34.04 43.94,34.04 45.72,35.81 v53.59,35.81 | v12.45,16.64 12.45,17.02 12.83,17.27 12.83,18.92 13.72,19.94 v13.72,20.83
N$37  (via drill 0.6)
  Top 0.406: U3.27 13.44,23.65 14.48,22.61 v14.48,22.1 | R16.2 14.48,15.37 v13.97,14.86
  Bottom 0.406: v14.48,22.1 14.99,21.59 14.99,19.94 13.72,18.67 13.72,15.62 13.97,15.24 v13.97,14.86
N$38
  Top 0.406: U3.24 11.02,24.66 11.81,23.88 11.81,22.06 R22.2
N$39  (via drill 0.6)
  Top 0.406: U3.2 17.42,38 18.92,39.5 v18.92,40.01
  Bottom 0.406: QEI1.2 6.85,45.08 7.75,45.97 7.75,47.62 8.26,48.01 17.91,48.01 18.8,47.12 v18.92,40.01
N$40  (via drill 0.6)
  Top 0.406: U3.3 16.61,38.84 v17.27,39.5
  Bottom 0.406: QEI1.4 6.89,42.58 7.37,43.05 7.37,44.07 8.76,45.47 8.76,46.86 9.14,47.24 17.27,47.24 17.91,46.61 17.91,40.89 17.4,40.39 17.4,39.62 v17.27,39.5
N$41  (via drill 0.6)
  Top 0.406: U3.42 18.9,33.63 18.41,33.15 10.79,33.15 v10.41,33.66
  Bottom 0.406: QEI2.2 6.72,10.79 8,11.81 8,19.3 6.35,20.95 6.35,28.7 8,30.35 8,32.89 8.64,33.66 v10.41,33.66
N$42  (via drill 0.6)
  Top 0.406: U3.43 18.57,34.44 18.03,33.91 12.06,33.91 v10.92,35.05
  Bottom 0.406: QEI2.4 6.76,8.29 8.89,10.41 8.89,19.68 7.24,21.34 7.24,28.32 8.89,29.97 8.89,32 9.4,32.51 11.05,32.51 11.56,33.02 11.56,34.42 v10.92,35.05
N$43
  Top 0.406: U2.7 26.69,22.59 26.42,22.86 R26.1
N$44
  Top 0.406: LED1.2 56.89,39.51 | 56.89,39.51 57.02,39.37 57.02,38.1 56.39,37.47 R24.1 | LED1.3 53.48,40.51 53.34,40.64 53.34,41.15 53.59,41.4 56.64,41.4 57.15,40.89 57.15,39.77 56.89,39.51
N$45
  Top 0.305: LED2.4 55.38,25.39 55.37,25.4 55.12,25.15 55.12,24.64 54.86,24.38 54.86,24.39 LED2.1
  Top 0.406: R25.2 56.64,34.42 56.9,34.16 56.9,25.78 56.52,25.4 LED2.4
N$46
  Top 0.406: U1.7 24.65,40.37 24,41.02 R27.1
N$47
  Top 0.406: U3.7 13.44,37.87 12.19,39.12 12,39.12 C1.1
VCC  (via drill 0.6)  (1 unrouted)
  Top 0.305: R18.1 18.54,12.32 18.92,11.94 20.57,11.94
  Top 0.406: U3.17 v10.29,31.24 10.41,31.37 | JP3.2 5.46,34.92 6.35,35.81 6.35,38.1 7.62,39.37 v7.62,39.62 8.64,39.62 R7.2 | R5.2 25.02,9.14 | 25.27,7.24 24.73,7.24 R4.2 | R5.2 25.27,9.14 25.65,9.53 25.65,10.92 25.23,10.92 R6.2 | 25.27,7.24 25.27,7.11 25.65,6.73 25.65,6.35 v25.78,6.22 | 25.27,7.24 25.53,7.24 25.65,7.37 25.65,8.47 | 25.65,8.47 R5.2 | v26.16,8.64 25.82,8.64 25.65,8.47 | R19.1 20.57,11.94 v20.57,11.43 19.94,10.79 | 18.77,32.03 U3.40 20.98,32.03 21.21,32.26 21.21,33.15 21.84,33.78 22.48,33.78 | R18.1 18.29,12.57 | 22.48,33.78 C9.1 | R13.1 24.64,34.16 24.51,34.04 22.73,34.04 22.48,33.78 | R12.1 11.3,46.74 8.76,44.2 v8.76,43.69 | R3.2 9.14,8.26 9.02,8.13 9.02,7.24 v9.53,6.73 | R2.2 12.32,13.21 11.68,13.84 11.05,13.84 | 11.05,13.84 11.05,13.3 R1.2 | v10.67,14.48 10.67,14.22 11.05,13.84 | C8.1 17.02,21.08 16.64,20.7 16.13,20.7 15.75,21.08 15.75,22.73 15.24,23.24 14.99,23.24 14.22,24 U3.28 14.22,26.54 13.72,27.05 13.72,28.07 14.22,28.57 15.37,28.57 15.88,28.07 17.14,28.07 18.41,29.34 18.41,31.67 18.77,32.03 | 18.77,32.03 18.31,32.03 18.29,32
  Top 0.61: v7.62,39.62 6.44,39.62 C10.1 | 10.41,31.37 11.05,31.37 11.68,32 18.29,32
  Bottom 0.406: v9.53,6.73 9.53,6.35 9.65,6.22 | v20.57,11.43 21.08,11.43 24.26,8.76 26.04,8.76 v26.16,8.64 | v8.76,43.69 8.76,40.13 7.75,39.12 | v10.67,14.48 9.91,14.48
  Bottom 0.61: P9.3 P9.4 | v9.53,6.73 9.91,7.11 9.91,14.48 9.91,20.19 8.26,21.84 8.26,27.81 10.16,29.72 10.16,30.99 10.29,31.11 v10.29,31.24 10.67,31.62 11.43,31.62 12.45,32.64 12.45,35.31 11.43,36.32 8.38,36.32 7.75,36.96 7.75,39.12 7.75,39.5 v7.62,39.62
  Bottom 0.813: v25.78,6.22 9.65,6.22 5.08,6.22 4.32,5.46 P9.4
VCC/2  (via drill 0.6)
  Top 0.406: C12.1 v4.57,23.62
  Top 0.61: P9.8 9.4,4.83 7.62,6.6 7.62,11.56 7.14,12.04 QEI2.1 | QEI1.1 6.19,46.33 6.6,46.74 C11.1
  Bottom 0.406: v4.57,23.62 3.43,23.62 3.17,23.88
  Bottom 0.61: P9.7 P9.8 | QEI2.1 3.21,12.04 2.67,12.7 2.67,19.05 3.17,19.56 3.17,23.88 3.17,40.13 2.03,41.15 2.03,45.21 3.15,46.33 QEI1.1

### Text on the board
tPlace: + | Motor 1 | + | Motor 2 | + | - | Dual Motor Control Shield - v1.0 | Battery